# Altium project T962a.PrjPCB
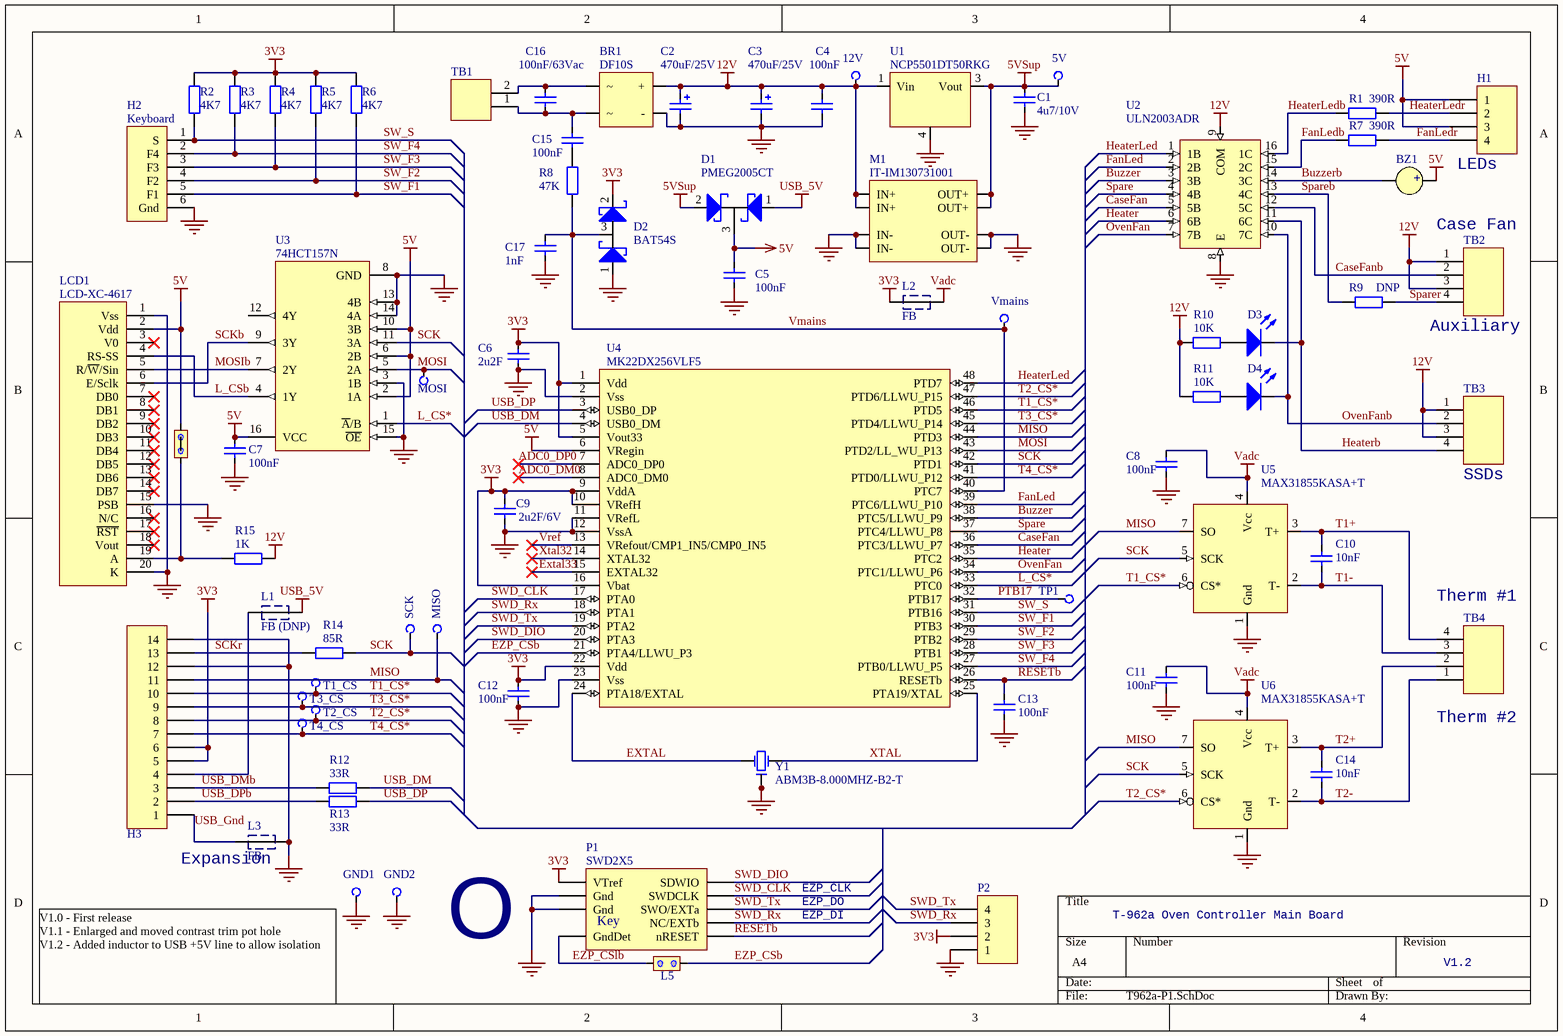
[diagram p0: T962a-P1.SchDoc]
ProjectRevision: V1.2
1 sheet, 75 parts. Net scope: global (net labels, ports and power ports of the same name join across sheets).
Board file: T962a.PcbDoc

## Sheet T962a-P1.SchDoc: T-962a Oven Controller Main Board
size A4; ProjectName: T-962a Oven Controller Main Board

### Parts
5V  TP  [PCBPIN - 0.9mm]  (value not drawn)
12V  TP  [PCBPIN - 0.9mm]  (value not drawn)
BR1  DF10S  [Bridge-SMT]
BZ1  Buzzer_PCB  [BUZZER_Small]  (value not drawn)
C1  4u7/10V  [CCNP2012-0805]
C2  470uF/25V  [RB5/10x13mm]
C3  470uF/25V  [RB5/10x13mm]
C4  100nF  [CCNP2012-0805]
C5  100nF  [CCNP2012-0805]
C6  2u2F  [CCNP2012-0805]
C7  100nF  [CCNP2012-0805]
C8  100nF  [CCNP2012-0805]
C9  2u2F/6V  [CCNP2012-0805]
C10  10nF  [CCNP2012-0805]
C11  100nF  [CCNP2012-0805]
C12  100nF  [CCNP2012-0805]
C13  100nF  [CCNP2012-0805]
C14  10nF  [CCNP2012-0805]
C15  100nF  [CCNP2012-0805]
C16  100nF/63Vac  [CAP - small MKT]
C17  1nF  [CCNP2012-0805]
D1  PMEG2005CT  [SOT23]
D2  BAT54S  [SOT23]
D3  LED Red  [LED-SMT-2]  (value not drawn)
D4  LED Red  [LED-SMT-2]  (value not drawn)
GND1  TP  [PCBPIN - 0.9mm]  (value not drawn)
GND2  TP  [PCBPIN - 0.9mm]  (value not drawn)
H1  Header 1x4  [HDR1X4S]  (value not drawn)
H2  Keyboard  [HDR1X6H]
H3  2x5 Header  [HDR2X7H]  (value not drawn)
L1  FB (DNP)  [CR2012-0805]  (no BOM)
L2  FB  [CR2012-0805]
L3  FB  [CR2012-0805]
L5  LinkOpen  [SolderBridge(Open)]  (value not drawn)  (net tie, no BOM)
L6  LinkClosed  [SolderBridge(Closed)]  (value not drawn)  (net tie, no BOM)
LCD1  LCD-XC-4617  [LCD_XC-4617]
Logo1  OSHW Logo  [OSHW]  (value not drawn)  (no BOM)
M1  IT-IM130731001  [IT-IM130731001]
MISO  TP  [PCBPIN - 0.9mm]  (value not drawn)
MOSI  TP  [PCBPIN - 0.9mm]  (value not drawn)
P1  SWD2X5  [SWD-2x5]
P2  Header 1x4  [HDR1X4S]  (value not drawn)
R1  390R  [CR2012-0805]
R2  4K7  [CR2012-0805]
R3  4K7  [CR2012-0805]
R4  4K7  [CR2012-0805]
R5  4K7  [CR2012-0805]
R6  4K7  [CR2012-0805]
R7  390R  [CR2012-0805]
R8  47K  [CR2012-0805]
R9  DNP  [CR2012-0805]
R10  10K  [CR2012-0805]
R11  10K  [CR2012-0805]
R12  33R  [CR2012-0805]
R13  33R  [CR2012-0805]
R14  85R  [CR2012-0805]
R15  1K  [CR2012-0805]
SCK  TP  [PCBPIN - 0.9mm]  (value not drawn)
T1_CS  TP  [PCBPIN - 0.9mm]  (value not drawn)
T2_CS  TP  [PCBPIN - 0.9mm]  (value not drawn)
T3_CS  TP  [PCBPIN - 0.9mm]  (value not drawn)
T4_CS  TP  [PCBPIN - 0.9mm]  (value not drawn)
TB1  Terminal2  [MOLEX-39544-3002]  (value not drawn)
TB2  Terminal4  [MOLEX-39544-3004]  (value not drawn)
TB3  Terminal4  [MOLEX-39544-3004]  (value not drawn)
TB4  Terminal4  [MOLEX-39544-3004]  (value not drawn)
TP1  TP  [PCBPIN - 0.9mm]  (value not drawn)
U1  NCP5501DT50RKG  [TO-252]
U2  ULN2003ADR  [SO-16_N]
U3  74HCT157N  [SO-16_N]
U4  MK22DX256VLF5  [TSQFP50P900X900-48M]
U5  MAX31855KASA+T  [SO-8_L]
U6  MAX31855KASA+T  [SO-8_L]
Vmains  TP  [PCBPIN - 0.9mm]  (value not drawn)
Y1  ABM3B-8.000MHZ-B2-T  [Crystal_SMT - ABM3B]

### Nets
3V3: C6.2 C9.2 C12.2 D2.2(A2) H3.5 H3.6 L2.1 P1.1(VTref) P2.2 R2.2 R3.2 R4.2 R5.2 R6.2 U4.1(Vdd) U4.5(Vout33) U4.9(VddA) U4.10(VRefH) U4.16(Vbat) U4.22(Vdd)
5V: BZ1.2(+) C5.2 C7.2 D1.3(K) H1.1 H1.3 L6.2 LCD1.2(Vdd) U3.2(1A) U3.6(2B) U3.10(3B) U3.16(VCC) U4.6(VRegin)
5VSup: 5V.1(TP) C1.2 D1.2(A2) M1.OUT0+(OUT+) M1.OUT1+(OUT+) U1.3(Vout)
12V: 12V.1(TP) BR1.1(+) C2.1 C3.1 C4.2 M1.IN0+(IN+) M1.IN1+(IN+) R10.1 R11.1 R15.2 TB2.1 TB2.3 TB3.1 TB3.3 U1.1(Vin) U2.9(COM)
GND: BR1.2(-) C1.1 C2.2 C3.2 C4.1 C5.1 C6.1 C7.1 C8.1 C9.1 C11.1 C12.1 C13.1 C17.1 D2.1(A1) GND1.1(TP) GND2.1(TP) H2.6(Gnd) H3.12 H3.14 L3.1 LCD1.1(Vss) LCD1.15(PSB) LCD1.20(K) M1.IN0-(IN-) M1.IN1-(IN-) M1.OUT0-(OUT-) M1.OUT1-(OUT-) P1.3(Gnd) P1.5(Gnd) P2.1 U1.4(Gnd_(Tab)) U2.8(E) U3.3(1B) U3.8(GND) U3.13(4B) U3.14(4A) U3.15(~{OE}) U4.2(Vss) U4.11(VRefL) U4.12(VssA) U4.23(Vss) U5.1(Gnd) U6.1(Gnd) Y1.2(Gnd) Y1.4(Gnd)
USB_5V: D1.1(A1) L1.1
Vadc: C8.2 C11.2 L2.2 U5.4(Vcc) U6.4(Vcc)
ADC0_DM0: U4.8(ADC0_DM0)
ADC0_DP0: U4.7(ADC0_DP0)
Buzzer: U2.3(3B) U4.38(PTC5/LLWU_P9)
Buzzerb: BZ1.1 U2.14(3C)
CaseFan: U2.5(5B) U4.36(PTC3/LLWU_P7)
CaseFanb: TB2.2 U2.12(5C)
EXTAL: U4.24(PTA18/EXTAL) Y1.1(OSC1)
Extal33: U4.15(EXTAL32)
EZP_CSb: L5.2 U4.21(PTA4/LLWU_P3)
EZP_CSlb: L5.1 P1.9(GndDet)
FanLed: U2.2(2B) U4.39(PTC6/LLWU_P10)
FanLedb: R7.1 U2.15(2C)
FanLedr: H1.4 R7.2
Heater: U2.6(6B) U4.35(PTC2)
Heaterb: D3.K TB3.4 U2.11(6C)
HeaterLed: U2.1(1B) U4.48(PTD7)
HeaterLedb: R1.1 U2.16(1C)
HeaterLedr: H1.2 R1.2
L_CS*: U3.1(~{A}/B) U4.33(PTC0)
L_CSb: LCD1.4(RS-SS) U3.4(1Y)
MISO: H3.11 MISO.1(TP) U4.44(PTD3) U5.7(SO) U6.7(SO)
MOSI: MOSI.1(TP) U3.5(2A) U4.43(PTD2/LL_WU_P13)
MOSIb: LCD1.5(R/~{W}/Sin) U3.7(2Y)
OvenFan: U2.7(7B) U4.34(PTC1/LLWU_P6)
OvenFanb: D4.K TB3.2 U2.10(7C)
PTB17: TP1.1(TP) U4.32(PTB17)
RESETb: C13.2 P1.10(nRESET) U4.26(RESETb)
SCK: R14.2 SCK.1(TP) U3.11(3A) U4.42(PTD1) U5.5(SCK) U6.5(SCK)
SCKb: LCD1.6(E/Sclk) U3.9(3Y)
SCKr: H3.13 R14.1
Spare: U2.4(4B) U4.37(PTC4/LLWU_P8)
Spareb: R9.1 U2.13(4C)
Sparer: R9.2 TB2.4
SW_F1: H2.5(F1) R6.1 U4.30(PTB3)
SW_F2: H2.4(F2) R5.1 U4.29(PTB2)
SW_F3: H2.3(F3) R4.1 U4.28(PTB1)
SW_F4: H2.2(F4) R3.1 U4.27(PTB0/LLWU_P5)
SW_S: H2.1(S) R2.1 U4.31(PTB16)
SWD_CLK: P1.4(SWDCLK) U4.17(PTA0)
SWD_DIO: P1.2(SDWIO) U4.20(PTA3)
SWD_Rx: P1.8(NC/EXTb) P2.3 U4.18(PTA1)
SWD_Tx: P1.6(SWO/EXTa) P2.4 U4.19(PTA2)
T1+: C10.2 TB4.4 U5.3(T+)
T1-: C10.1 TB4.3 U5.2(T-)
T1_CS*: H3.10 T1_CS.1(TP) U4.46(PTD5) U5.6(CS*)
T2+: C14.2 TB4.2 U6.3(T+)
T2-: C14.1 TB4.1 U6.2(T-)
T2_CS*: H3.8 T2_CS.1(TP) U4.47(PTD6/LLWU_P15) U6.6(CS*)
T3_CS*: H3.9 T3_CS.1(TP) U4.45(PTD4/LLWU_P14)
T4_CS*: H3.7 T4_CS.1(TP) U4.41(PTD0/LLWU_P12)
USB_DM: R12.2 U4.4(USB0_DM)
USB_DMb: H3.3 R12.1
USB_DP: R13.2 U4.3(USB0_DP)
USB_DPb: H3.2 R13.1
USB_Gnd: H3.1 L3.2
Vmains: C17.2 D2.3(K) R8.1 U4.40(PTC7) Vmains.1(TP)
Vref: U4.13(VRefout/CMP1_IN5/CMP0_IN5)
XTAL: U4.25(PTA19/XTAL) Y1.3(OSC2)
Xtal32: U4.14(XTAL32)
NetBR1_3: BR1.3 C15.2 C16.1 TB1.1
NetBR1_4: BR1.4 C16.2 TB1.2
NetC15_1: C15.1 R8.2
NetD3_A: D3.A R10.2
NetD4_A: D4.A R11.2
NetH3_4: H3.4 L1.2
NetL6_1: L6.1 LCD1.19(A) R15.1

Not connected (* = marked no-connect by the designer): LCD1 3(V0)* 7(DB0)* 8(DB1)* 9(DB2)* 10(DB3)* 11(DB4)* 12(DB5)* 13(DB6)* 14(DB7)* 16(N/C)* 17(~{RST})* 18(Vout)*; U3 12(4Y); U5 8(NC); U6 8(NC)

### Notes on the sheet
- (near H1) LEDs
- Case Fan
- (near TB2) Auxiliary
- (near TB3) SSDs
- (near TB4) Therm #1
- (near TB4) Therm #2
- (near H3) Expansion
- EZP_CLK
- EZP_DO
- EZP_DI
- (near GND1) V1.0 - First release
  V1.1 - Enlarged and moved contrast trim pot hole
  V1.2 - Added inductor to USB +5V line to allow isolation
- (in symbol OSHW Logo) O
- (in symbol SWD2X5) Key

### Library data of the parts
5V 12V GND1 GND2 MISO MOSI SCK T1_CS T2_CS T3_CS T4_CS TP1 Vmains = TP: Test Point; Digikey: *; Farnell PN: *
BR1 = DF10S: bRIDGE rECTIFIER; Farnell PN: 2101164
BZ1 = Buzzer_PCB: Buzzer (Adafruit 1536); Adafruit PN: 1536
C1 C8 C10 C11 C13 C14 = Cap_CCNP_0805: Capacitor SMT 0805; Manufacturer: Generic Components; Class: Passive; Published: 08/06/2000; Publisher: Altium Hobart Technology Centre; SubClass: Capacitor; Farnell PN: *; Digikey: *
  C1: Value: 4u7/10V
  C8 C11 C13: Value: 100nF
  C10 C14: Value: 10nF
C2 C3 = Cap-25ZLS470MEFC10X12: Polarized Capacitor; Manufacturer: Generic Components; Class: Passive; Published: 08/06/2000; Publisher: Altium Hobart Technology Centre; SubClass: Capacitor; Farnell PN: 2469425; Digikey: *; Value: 470uF/25V
C4-C7 C9 C12 C15-C17 = Cap: Capacitor; Manufacturer: Generic Components; Class: Passive; Published: 08/06/2000; Publisher: Altium Hobart Technology Centre; SubClass: Capacitor; Digikey: *
  C4 C5 C7 C12 C15: Farnell PN: *; Value: 100nF
  C6: Farnell PN: *; Value: 2u2F
  C9: Farnell PN: *; Value: 2u2F/6V
  C16: Farnell PN: 2429336; Value: 100nF/63Vac
  C17: Farnell PN: *; Value: 1nF
D1 = PMEG2005CT: Dual Schottky Diode (SMT); Digikey: *; Farnell PN: 2459194
D2 = BAT54S: Dual Diode (SMT); Digikey: *; Farnell PN: F1467519
D3 D4 = LED SMT,Red: LED (Red SMT); Manufacturer: Generic Components; Class I: Optoelectronic; Published: 8-Jun-2000; Revision: July-2002: Re-released for DXP Platform.; Publisher: Altium Limited; Class II: LED; Farnell PN: 5790839; Digikey: *
H1 P2 = Header 1x4: Header, 5-Pin, Right Angle; LatestRevisionDate: 17-Jul-2002; LatestRevisionNote: Re-released for DXP Platform.; Publisher: Altium Limited
H2 = Header 6: Header, 6-Pin; LatestRevisionDate: 17-Jul-2002; LatestRevisionNote: Re-released for DXP Platform.; Publisher: Altium Limited
H3 = Header 2x7H: Header 2x7
L1-L3 = Ferrite Bead 0805: Ferrite Bead (0805) 0.045OHM, 2A; Farnell PN: 1515661; Digikey: *
LCD1 = LCD-XC-4617: LCD 128 x 64 pixel, ST7920 controller & contrast pot (Jaycar XC-4617)
M1 = IT-IM130731001: Itead Buck converter
P1 = SWD2X5: SWD Connector 2x5-Pin; LatestRevisionDate: 17-Jul-2002; LatestRevisionNote: Re-released for DXP Platform.; Publisher: Altium Limited
R1-R15 = Res_CR0805: Resistor; Manufacturer: Generic Components; Class: Passive; Published: 08/06/2000; Publisher: Altium Hobart Technology Centre; SubClass: Resistor; Farnell PN: *; Digikey: *
  R1 R7: Value: 390R
  R2-R6: Value: 4K7
  R8: Value: 47K
  R9: Value: DNP
  R10 R11: Value: 10K
  R12 R13: Value: 33R
  R14: Value: 85R
  R15: Value: 1K
TB1 = Terminal2: MULTICOMP  MC24366 Wire-To-Board Terminal Block; Farnell PN: 2396251
TB2-TB4 = Terminal4: MULTICOMP MC24368 Wire-To-Board Terminal Block; Farnell PN: 1624302
U1 = NCP5501DT50RKG: Fixed LDO Voltage Regulator, 2.5V-16V in, 230mV Dropout, 5V/500mA out, TO-252-3; Farnell PN: 2532866
U3 = 74HCT157N: Quad 2-1 Multiplexor
U4 = MK22DX256VLF5: Arm Cortex M4; Farnell PN: *
Y1 = ABM3B-8.000MHZ-B2-T: Crystal 8MHz (MINIATURE SMT ABM3B); Manufacturer: Generic Components; Class: Oscillator; SubClass: Crystal Oscillator; Published: 08/06/2000; Publisher: Altium Hobart Technology Centre; Digikey: *; Farnell PN: 2467818
U2 = ULN2003ADR: Farnell PN: 1470513
U5 U6 = MAX31855KASA+T: Farnell PN: 2515622